# EAGLE design LPC1114FN28_OnBoard (EAGLE 5.11)
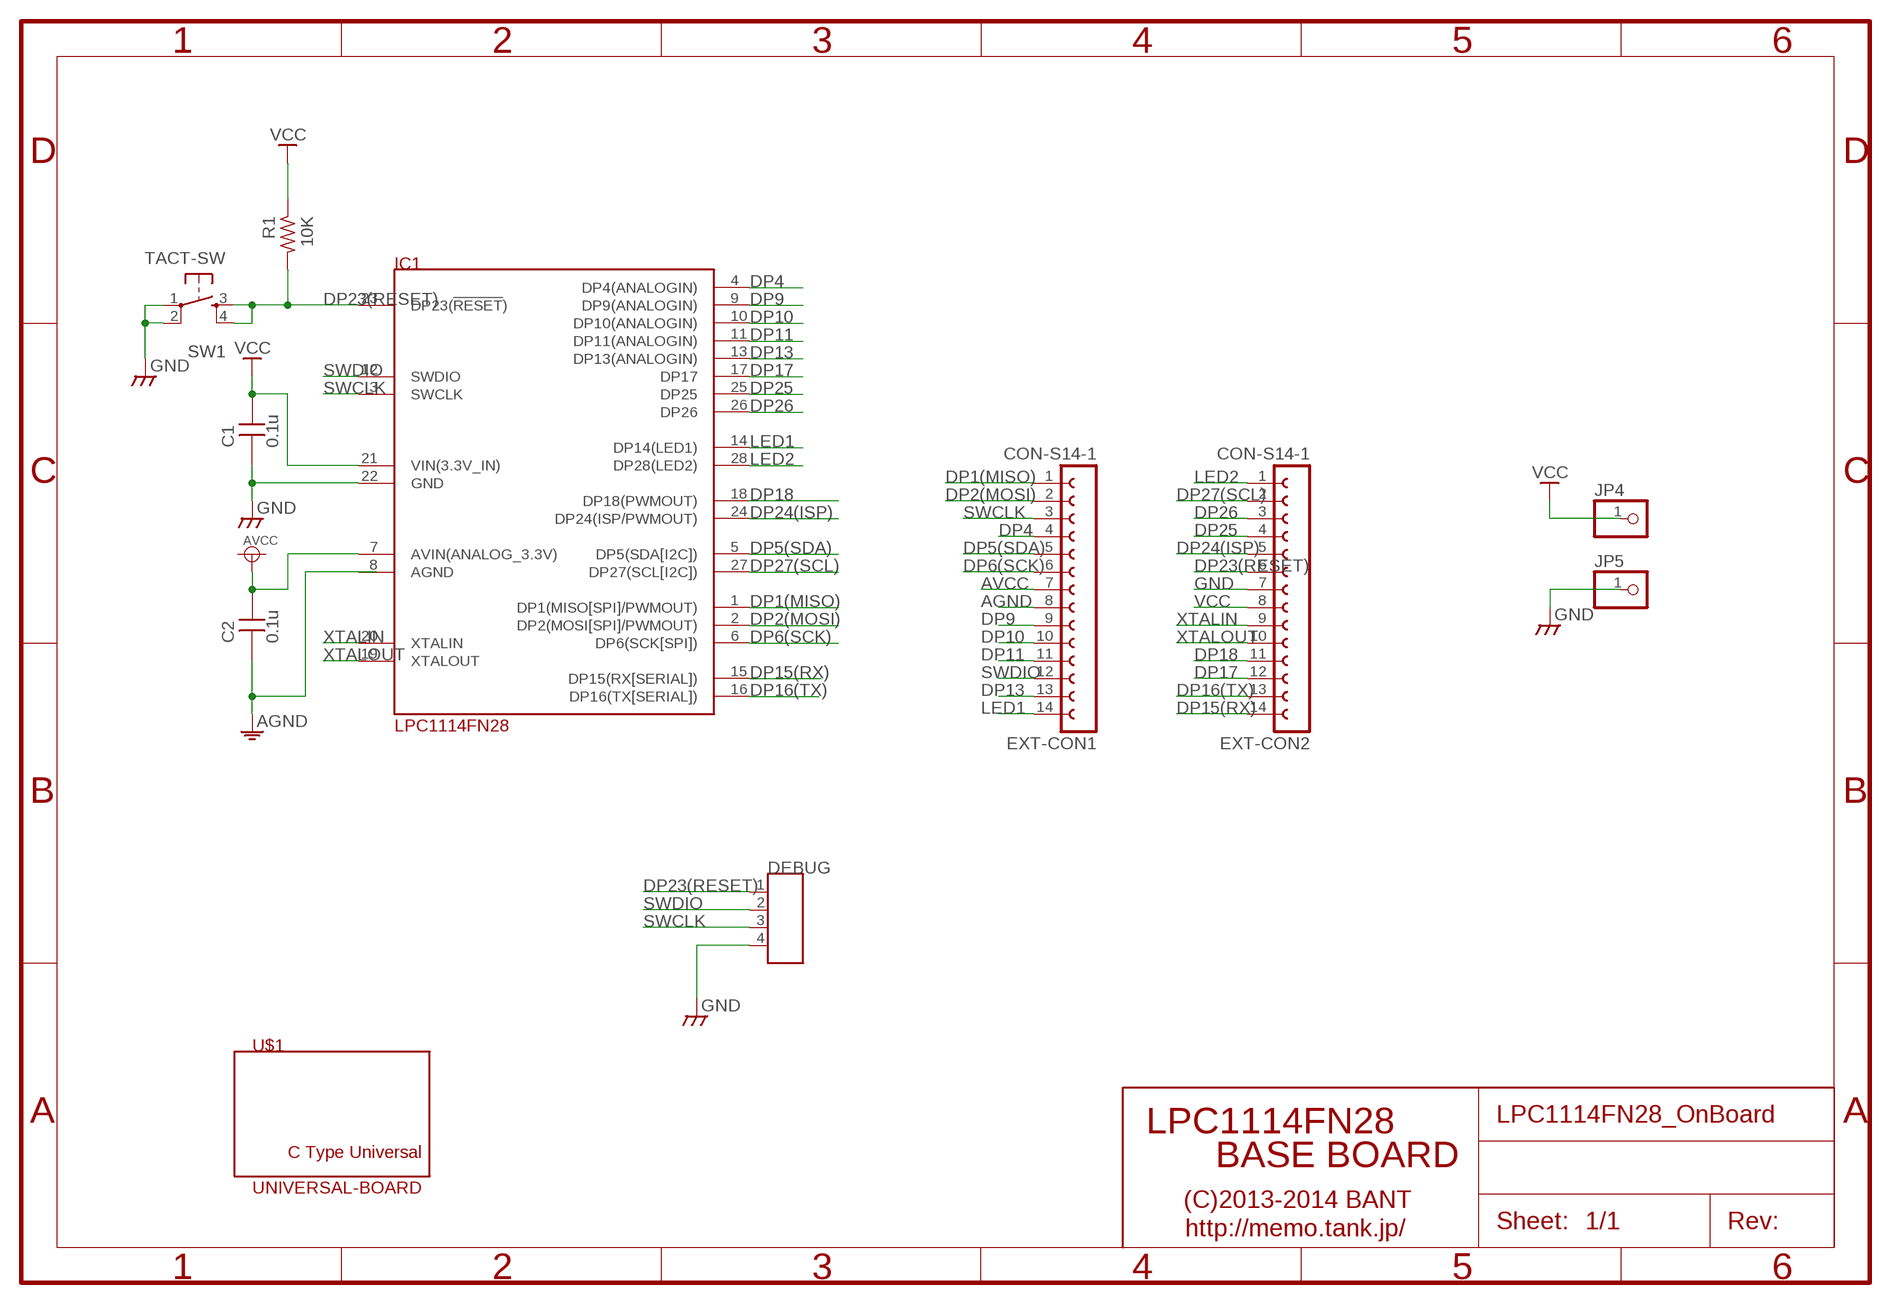
[diagram p0: schematic, sheet 1]

## Parts
C1  0.1u  CAPDIP_1  [CAP_DIP_1]
C2  0.1u  CAPDIP_1  [CAP_DIP_1]
DEBUG  CON_4P  [CON_HRS_DIP_4]
EXT-CON1  CON-S14-1  [CON-S14-1]
EXT-CON2  CON-S14-1  [CON-S14-1]
IC1  LPC1114FN28  [DIL28]
JP4  PINHD-1X01_2.54  [1X01]
JP5  PINHD-1X01_2.54  [1X01]
R1  10K  R0.125W_4P  [R_0.125W_4]
SW1  TACT-SW  [B3F-10X]
U$1  UNIVERSAL-BOARD  [ORG-UNIVASAL1]

## Nets
AGND: C2.1 EXT-CON1.8 IC1.8(AGND)
AVCC: C2.2 EXT-CON1.7 IC1.7(AVIN(ANALOG_3.3V))
DP1(MISO): EXT-CON1.1 IC1.1(DP1(MISO[SPI]/PWMOUT))
DP2(MOSI): EXT-CON1.2 IC1.2(DP2(MOSI[SPI]/PWMOUT))
DP4: EXT-CON1.4 IC1.4(DP4(ANALOGIN))
DP5(SDA): EXT-CON1.5 IC1.5(DP5(SDA[I2C]))
DP6(SCK): EXT-CON1.6 IC1.6(DP6(SCK[SPI]))
DP9: EXT-CON1.9 IC1.9(DP9(ANALOGIN))
DP10: EXT-CON1.10 IC1.10(DP10(ANALOGIN))
DP11: EXT-CON1.11 IC1.11(DP11(ANALOGIN))
DP13: EXT-CON1.13 IC1.13(DP13(ANALOGIN))
DP15(RX): EXT-CON2.14 IC1.15(DP15(RX[SERIAL]))
DP16(TX): EXT-CON2.13 IC1.16(DP16(TX[SERIAL]))
DP17: EXT-CON2.12 IC1.17(DP17)
DP18: EXT-CON2.11 IC1.18(DP18(PWMOUT))
DP23(RESET): DEBUG.1 EXT-CON2.6 IC1.23(DP23(!RESET!)) R1.2 SW1.3(S) SW1.4(S1)
DP24(ISP): EXT-CON2.5 IC1.24(DP24(ISP/PWMOUT))
DP25: EXT-CON2.4 IC1.25(DP25)
DP26: EXT-CON2.3 IC1.26(DP26)
DP27(SCL): EXT-CON2.2 IC1.27(DP27(SCL[I2C]))
GND: C1.1 DEBUG.4 EXT-CON2.7 IC1.22(GND) JP5.1 SW1.1(P) SW1.2(P1)
LED1: EXT-CON1.14 IC1.14(DP14(LED1))
LED2: EXT-CON2.1 IC1.28(DP28(LED2))
SWCLK: DEBUG.3 EXT-CON1.3 IC1.3(SWCLK)
SWDIO: DEBUG.2 EXT-CON1.12 IC1.12(SWDIO)
VCC: C1.2 EXT-CON2.8 IC1.21(VIN(3.3V_IN)) JP4.1 R1.1
XTALIN: EXT-CON2.9 IC1.20(XTALIN)
XTALOUT: EXT-CON2.10 IC1.19(XTALOUT)

## Notes on the sheet
- LPC1114FN28
- BASE BOARD
- (C)2013-2014 BANT
- http://memo.tank.jp/

## Library data of the parts
C1 C2 = MyLib:CAP: Non polar capacitor
DEBUG = MyLib:CON_4P: 4P Molex Connector
EXT-CON1 EXT-CON2 = bant:CON-S14-1
IC1 = bant:LPC1114FN28
JP4 JP5 = pinheader:PINHD-1X01: PIN HEADER
R1 = MyLib:R: General Resiter 1/8W 1/4W 1/2W V/H
SW1 = MyLib:TACT-SW: Tacticle Push Switch
U$1 = bant:UNIVERSAL-BOARD

## Board
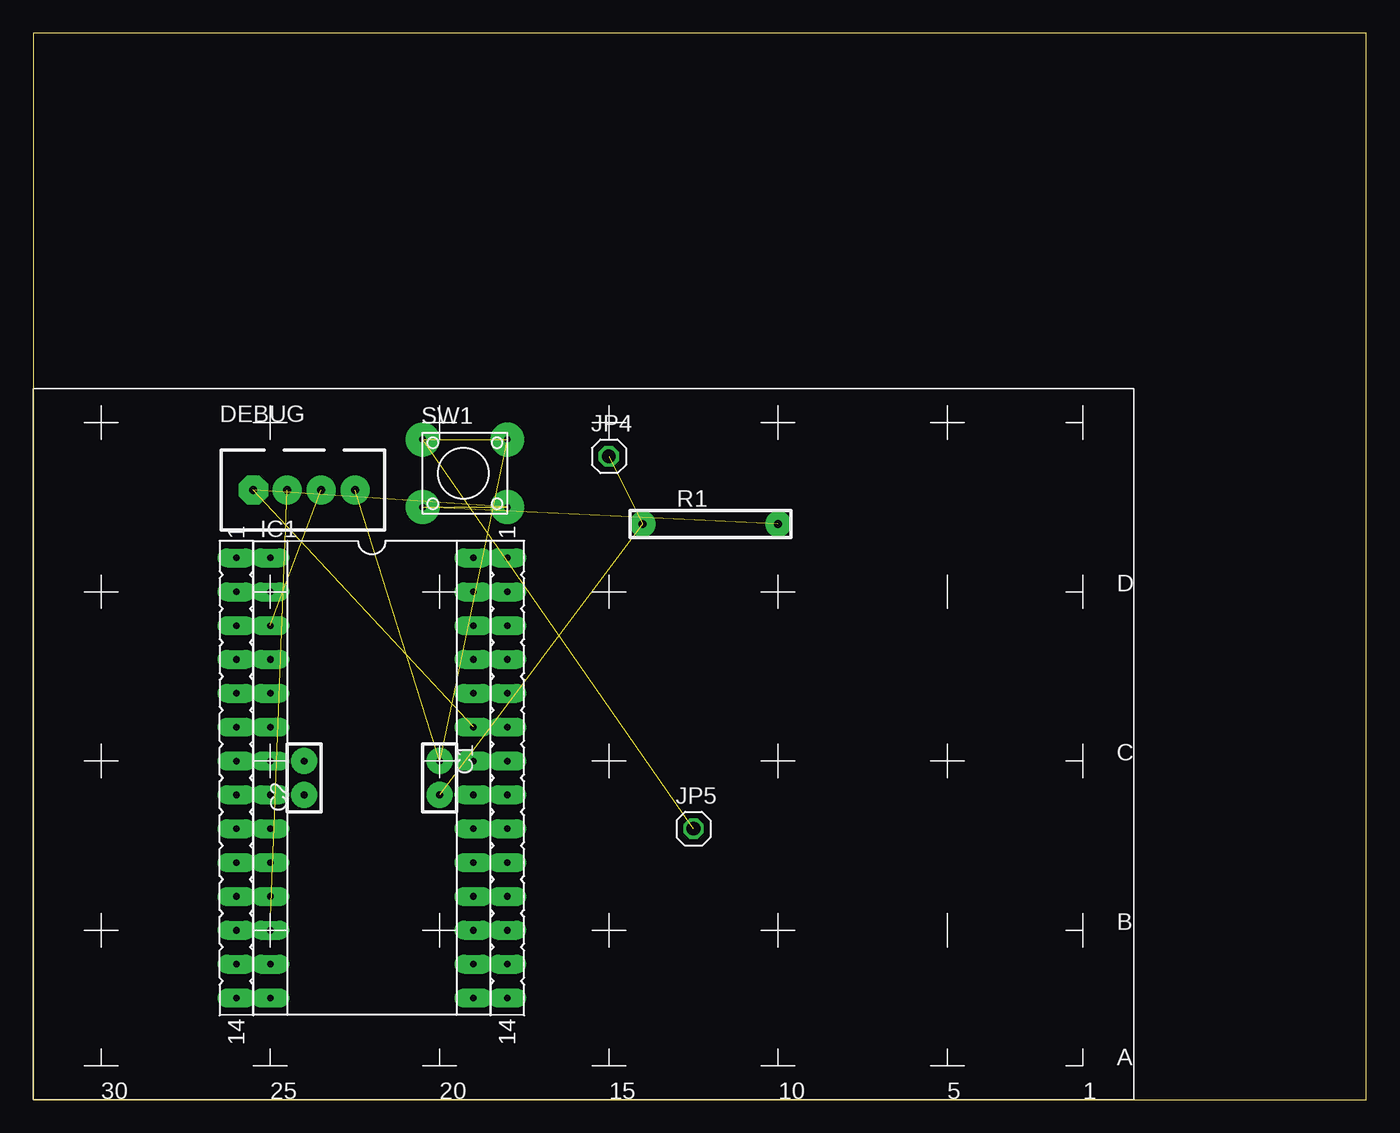
[diagram p1: board, top side]
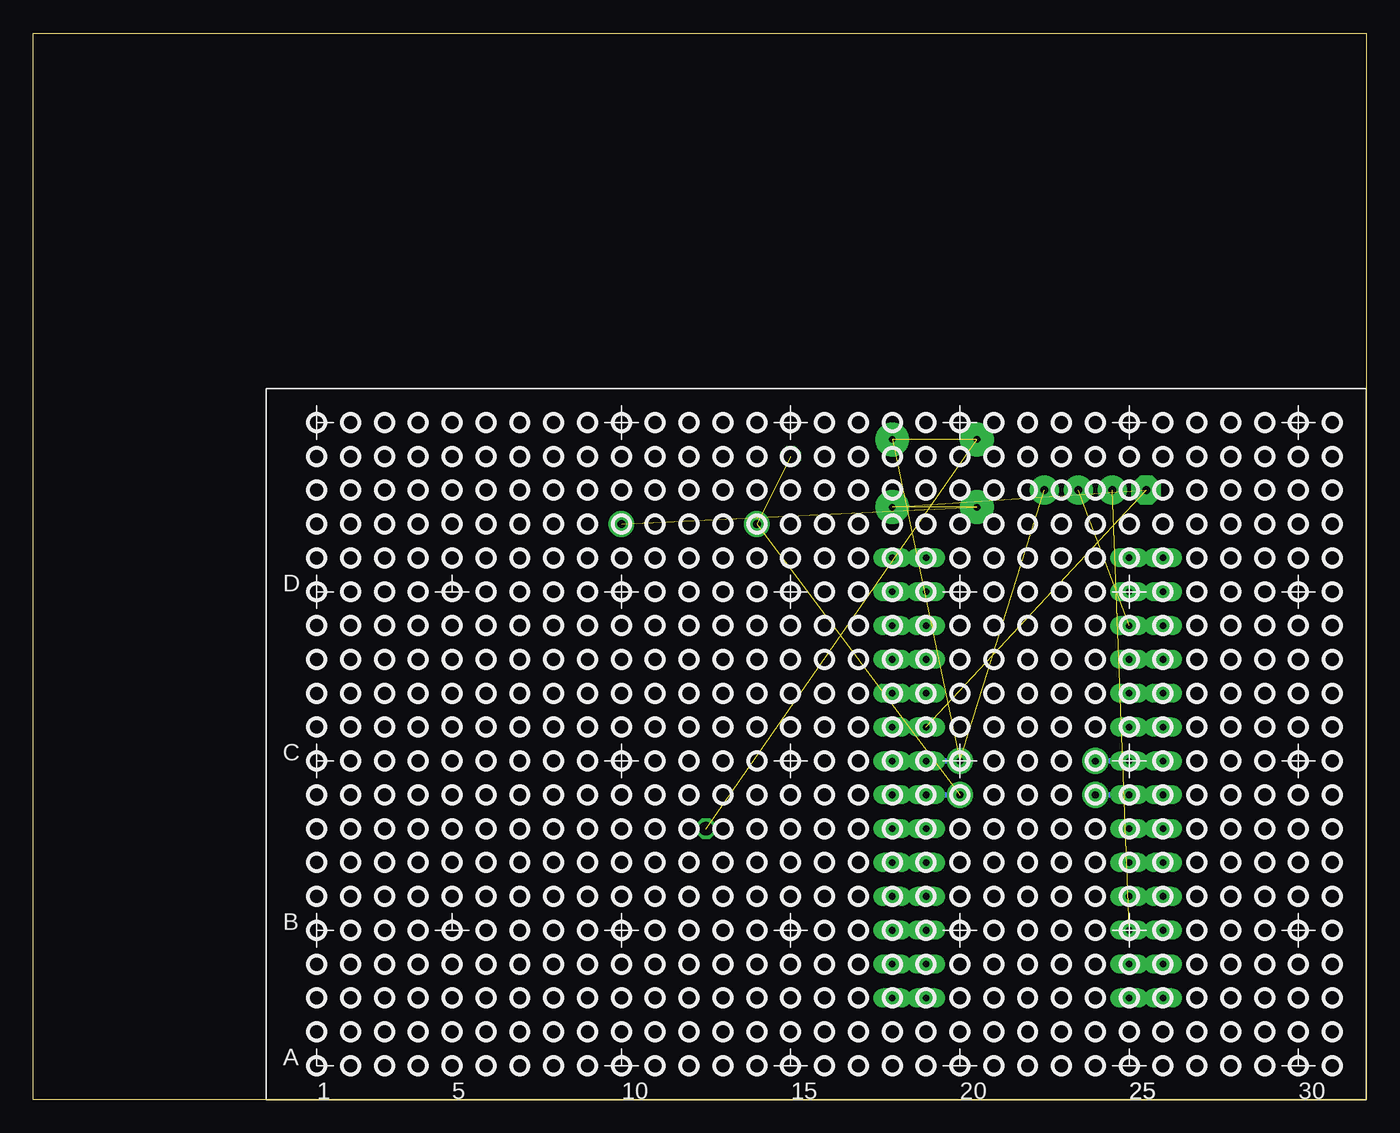
[diagram p2: board, bottom side, seen from below]

Size 100 x 80 mm. Coordinates in mm from the lower left corner, seen from the top.
Outline: 0,0 100,0 100,80 0,80 0,0
Copper layers (1*16): Top 0.035mm / dielectric 1.5mm / Bottom 0.035mm
Design rules "default": minimum track width 10mil, minimum drill 24mil, track to track 8mil, track to pad 8mil, pad to pad 8mil, via to via 8mil, smd to smd 8mil, copper to edge 40mil, drill to drill 8mil, minimum pad ring 10mil, minimum via ring 8mil, stop-mask expansion 4mil, vias tented up to drill 0mil, thermal gap 10mil

### Footprints (pad centres in the part's own frame; a part is rotated, then mirrored left to right if it is on the bottom)
CAP_DIP_1 = drill 0.5 pad 1.93 round: 1 -1.27,0; 2 1.27,0
CON_HRS_DIP_4 = drill 0.6 pad 2.184 octagon: 1 -3.81,0 | drill 0.6 pad 2.184 round: 2 -1.27,0; 3 1.27,0; 4 3.81,0
CON-S14-1 = drill 0.5 pad 1.422 long: 1 -16.51,0; 2 -13.97,0; 3 -11.43,0; 4 -8.89,0; 5 -6.35,0; 6 -3.81,0; 7 -1.27,0; 8 1.27,0; 9 3.81,0; 10 6.35,0; 11 8.89,0; 12 11.43,0; 13 13.97,0; 14 16.51,0
DIL28 = drill 0.5 pad 1.422 long: 1 -15.24,-7.62; 2 -12.7,-7.62; 3 -10.16,-7.62; 4 -7.62,-7.62; 5 -5.08,-7.62; 6 -2.54,-7.62; 7 0,-7.62; 8 2.54,-7.62; 9 5.08,-7.62; 10 7.62,-7.62; 11 10.16,-7.62; 12 12.7,-7.62; 13 15.24,-7.62; 14 17.78,-7.62; 15 17.78,7.62; 16 15.24,7.62; 17 12.7,7.62; 18 10.16,7.62; 19 7.62,7.62; 20 5.08,7.62; 21 2.54,7.62; 22 0,7.62; 23 -2.54,7.62; 24 -5.08,7.62; 25 -7.62,7.62; 26 -10.16,7.62; 27 -12.7,7.62; 28 -15.24,7.62
1X01 = drill 1.016 octagon: 1 0,0
R_0.125W_4 = drill 0.6 pad 1.93 round: 1 -5.08,0; 2 5.08,0
B3F-10X = drill 0.5 pad 2.54 round: 1 -1.27,2.54; 2 5.08,2.54; 3 -1.27,-2.54; 4 5.08,-2.54

### Placement (x,y rotation side)
C1  30.48,24.13 270 top
C2  20.32,24.13 90 top
DEBUG  20.32,45.72 0 top
EXT-CON1  15.24,24.13 270 top
EXT-CON2  35.56,24.13 270 top
IC1  25.4,25.4 270 top
JP4  43.18,48.26 0 top
JP5  49.53,20.32 0 top
R1  50.8,43.18 0 top
SW1  30.48,46.99 0 top
U$1  0,0 0 top

### Tracks (layer width: path | path; a pad name or v marks a point on that pad's centre or on a via)
AGND
  Bottom 0.406: EXT-CON1.8 IC1.8 C2.1
AVCC
  Bottom 0.406: EXT-CON1.7 IC1.7 C2.2
DP1(MISO)
  Bottom 0.406: EXT-CON1.1 IC1.1
DP2(MOSI)
  Bottom 0.406: EXT-CON1.2 IC1.2
DP4
  Bottom 0.406: EXT-CON1.4 IC1.4
DP5(SDA)
  Bottom 0.406: EXT-CON1.5 IC1.5
DP6(SCK)
  Bottom 0.406: EXT-CON1.6 IC1.6
DP9
  Bottom 0.406: EXT-CON1.9 IC1.9
DP10
  Bottom 0.406: EXT-CON1.10 IC1.10
DP11
  Bottom 0.406: EXT-CON1.11 IC1.11
DP13
  Bottom 0.406: EXT-CON1.13 IC1.13
DP15(RX)
  Bottom 0.406: EXT-CON2.14 IC1.15
DP16(TX)
  Bottom 0.406: EXT-CON2.13 IC1.16
DP17
  Bottom 0.406: EXT-CON2.12 IC1.17
DP18
  Bottom 0.406: EXT-CON2.11 IC1.18
DP23(RESET)  (4 unrouted)
  Bottom 0.406: IC1.23 EXT-CON2.6
DP24(ISP)
  Bottom 0.406: EXT-CON2.5 IC1.24
DP25
  Bottom 0.406: EXT-CON2.4 IC1.25
DP26
  Bottom 0.406: EXT-CON2.3 IC1.26
DP27(SCL)
  Bottom 0.406: EXT-CON2.2 IC1.27
GND  (4 unrouted)
  Bottom 0.406: EXT-CON2.7 IC1.22 C1.1
LED1
  Bottom 0.406: EXT-CON1.14 IC1.14
LED2
  Bottom 0.406: EXT-CON2.1 IC1.28
SWCLK  (1 unrouted)
  Bottom 0.406: EXT-CON1.3 IC1.3
SWDIO  (1 unrouted)
  Bottom 0.406: EXT-CON1.12 IC1.12
VCC  (2 unrouted)
  Bottom 0.406: EXT-CON2.8 IC1.21 C1.2
XTALIN
  Bottom 0.406: EXT-CON2.9 IC1.20
XTALOUT
  Bottom 0.406: EXT-CON2.10 IC1.19